# EasyEDA schematic nlp_base_0.2.json
TITLE: Sheet_1; REV: 1.0; Date: 2022-02-16; Sheet: 1/1; Company: Your Company
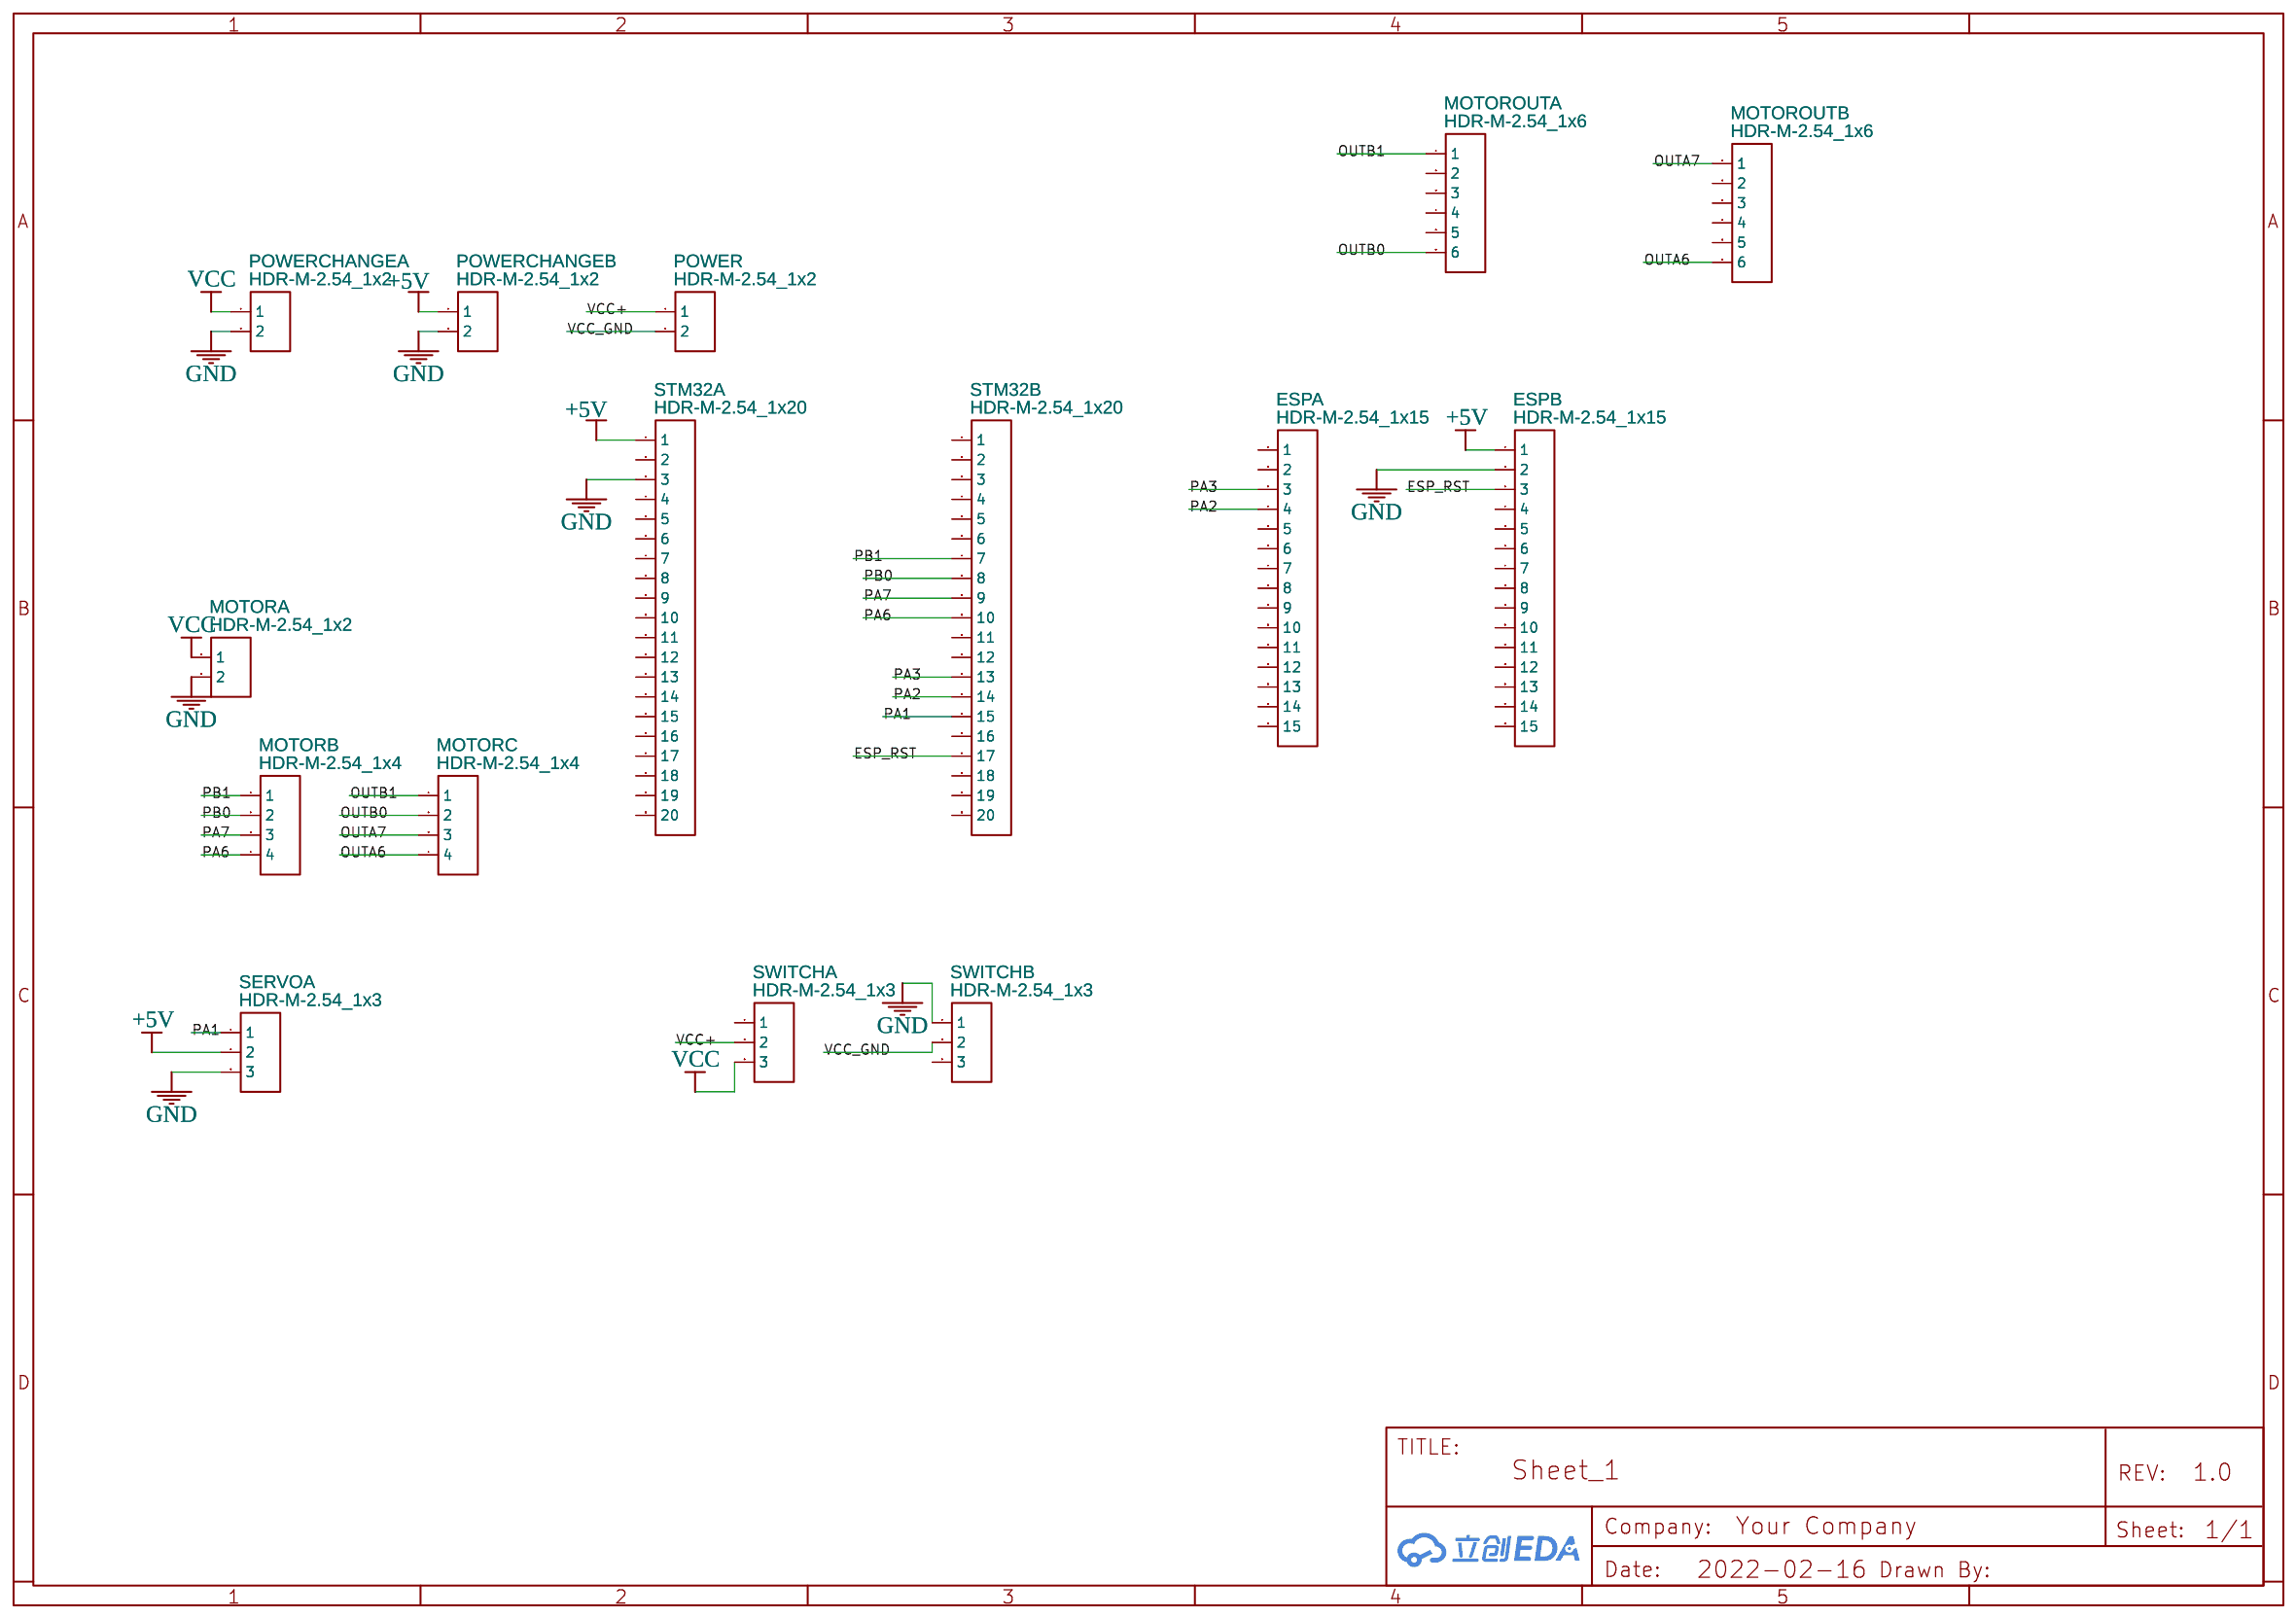
[diagram p0: schematic sheet]

## Parts
ESPA  HDR-M-2.54_1x15  [HDR-M-2.54_1X15]
ESPB  HDR-M-2.54_1x15  [HDR-M-2.54_1X15]
MOTORA  HDR-M-2.54_1x2  [HDR-M-2.54_1X2]
MOTORB  HDR-M-2.54_1x4  [HDR-M-2.54_1X4]
MOTORC  HDR-M-2.54_1x4  [HDR-M-2.54_1X4]
MOTOROUTA  HDR-M-2.54_1x6  [HDR-M-2.54_1X6]
MOTOROUTB  HDR-M-2.54_1x6  [HDR-M-2.54_1X6]
POWER  HDR-M-2.54_1x2  [HDR-M-2.54_1X2]
POWERCHANGEA  HDR-M-2.54_1x2  [HDR-M-2.54_1X2]
POWERCHANGEB  HDR-M-2.54_1x2  [HDR-M-2.54_1X2]
SERVOA  HDR-M-2.54_1x3  [HDR-M-2.54_1X3]
STM32A  HDR-M-2.54_1x20  [HDR-M-2.54_1X20]
STM32B  HDR-M-2.54_1x20  [HDR-M-2.54_1X20]
SWITCHA  HDR-M-2.54_1x3  [HDR-M-2.54_1X3]
SWITCHB  HDR-M-2.54_1x3  [HDR-M-2.54_1X3]

## Library data of the parts
ESPA ESPB = HDR-M-2.54_1x15: Supplier Part: C124373; Supplier: LCSC; Contributor: LCEDA_Lib
MOTORA POWER POWERCHANGEA POWERCHANGEB = HDR-M-2.54_1x2: Supplier Part: C124375; Supplier: LCSC; Contributor: LCEDA_Lib
MOTORB MOTORC = HDR-M-2.54_1x4: Supplier Part: C124378; Supplier: LCSC; Contributor: LCEDA_Lib
MOTOROUTA MOTOROUTB = HDR-M-2.54_1x6: Supplier Part: C190819; Supplier: LCSC; Contributor: LCEDA_Lib
SERVOA SWITCHA SWITCHB = HDR-M-2.54_1x3: Supplier Part: C180248; Supplier: LCSC; Contributor: LCEDA_Lib
STM32A STM32B = HDR-M-2.54_1x20: Supplier Part: C50981; Supplier: LCSC; Contributor: LCEDA_Lib

## Nets
+5V: ESPB.1 POWERCHANGEB.1 SERVOA.2 STM32A.1
GND: ESPB.2 MOTORA.2 POWERCHANGEA.2 POWERCHANGEB.2 SERVOA.3 STM32A.3 SWITCHB.1
VCC: MOTORA.1 POWERCHANGEA.1 SWITCHA.3
VCC+: POWER.1 SWITCHA.2
VCC_GND: POWER.2 SWITCHB.2
ESP_RST: ESPB.3 STM32B.17
OUTA6: MOTORC.4 MOTOROUTB.6
OUTA7: MOTORC.3 MOTOROUTB.1
OUTB0: MOTORC.2 MOTOROUTA.6
OUTB1: MOTORC.1 MOTOROUTA.1
PA1: SERVOA.1 STM32B.15
PA2: ESPA.4 STM32B.14
PA3: ESPA.3 STM32B.13
PA6: MOTORB.4 STM32B.10
PA7: MOTORB.3 STM32B.9
PB0: MOTORB.2 STM32B.8
PB1: MOTORB.1 STM32B.7

Not connected (* = marked no-connect by the designer): ESPA 1 2 5 6 7 8 9 10 11 12 13 14 15; ESPB 4 5 6 7 8 9 10 11 12 13 14 15; MOTOROUTA 2 3 4 5; MOTOROUTB 2 3 4 5; STM32A 2 4 5 6 7 8 9 10 11 12 13 14 15 16 17 18 19 20; STM32B 1 2 3 4 5 6 11 12 16 18 19 20; SWITCHA 1; SWITCHB 3
